# EAGLE design EtchASketch (EAGLE 9.6.2)
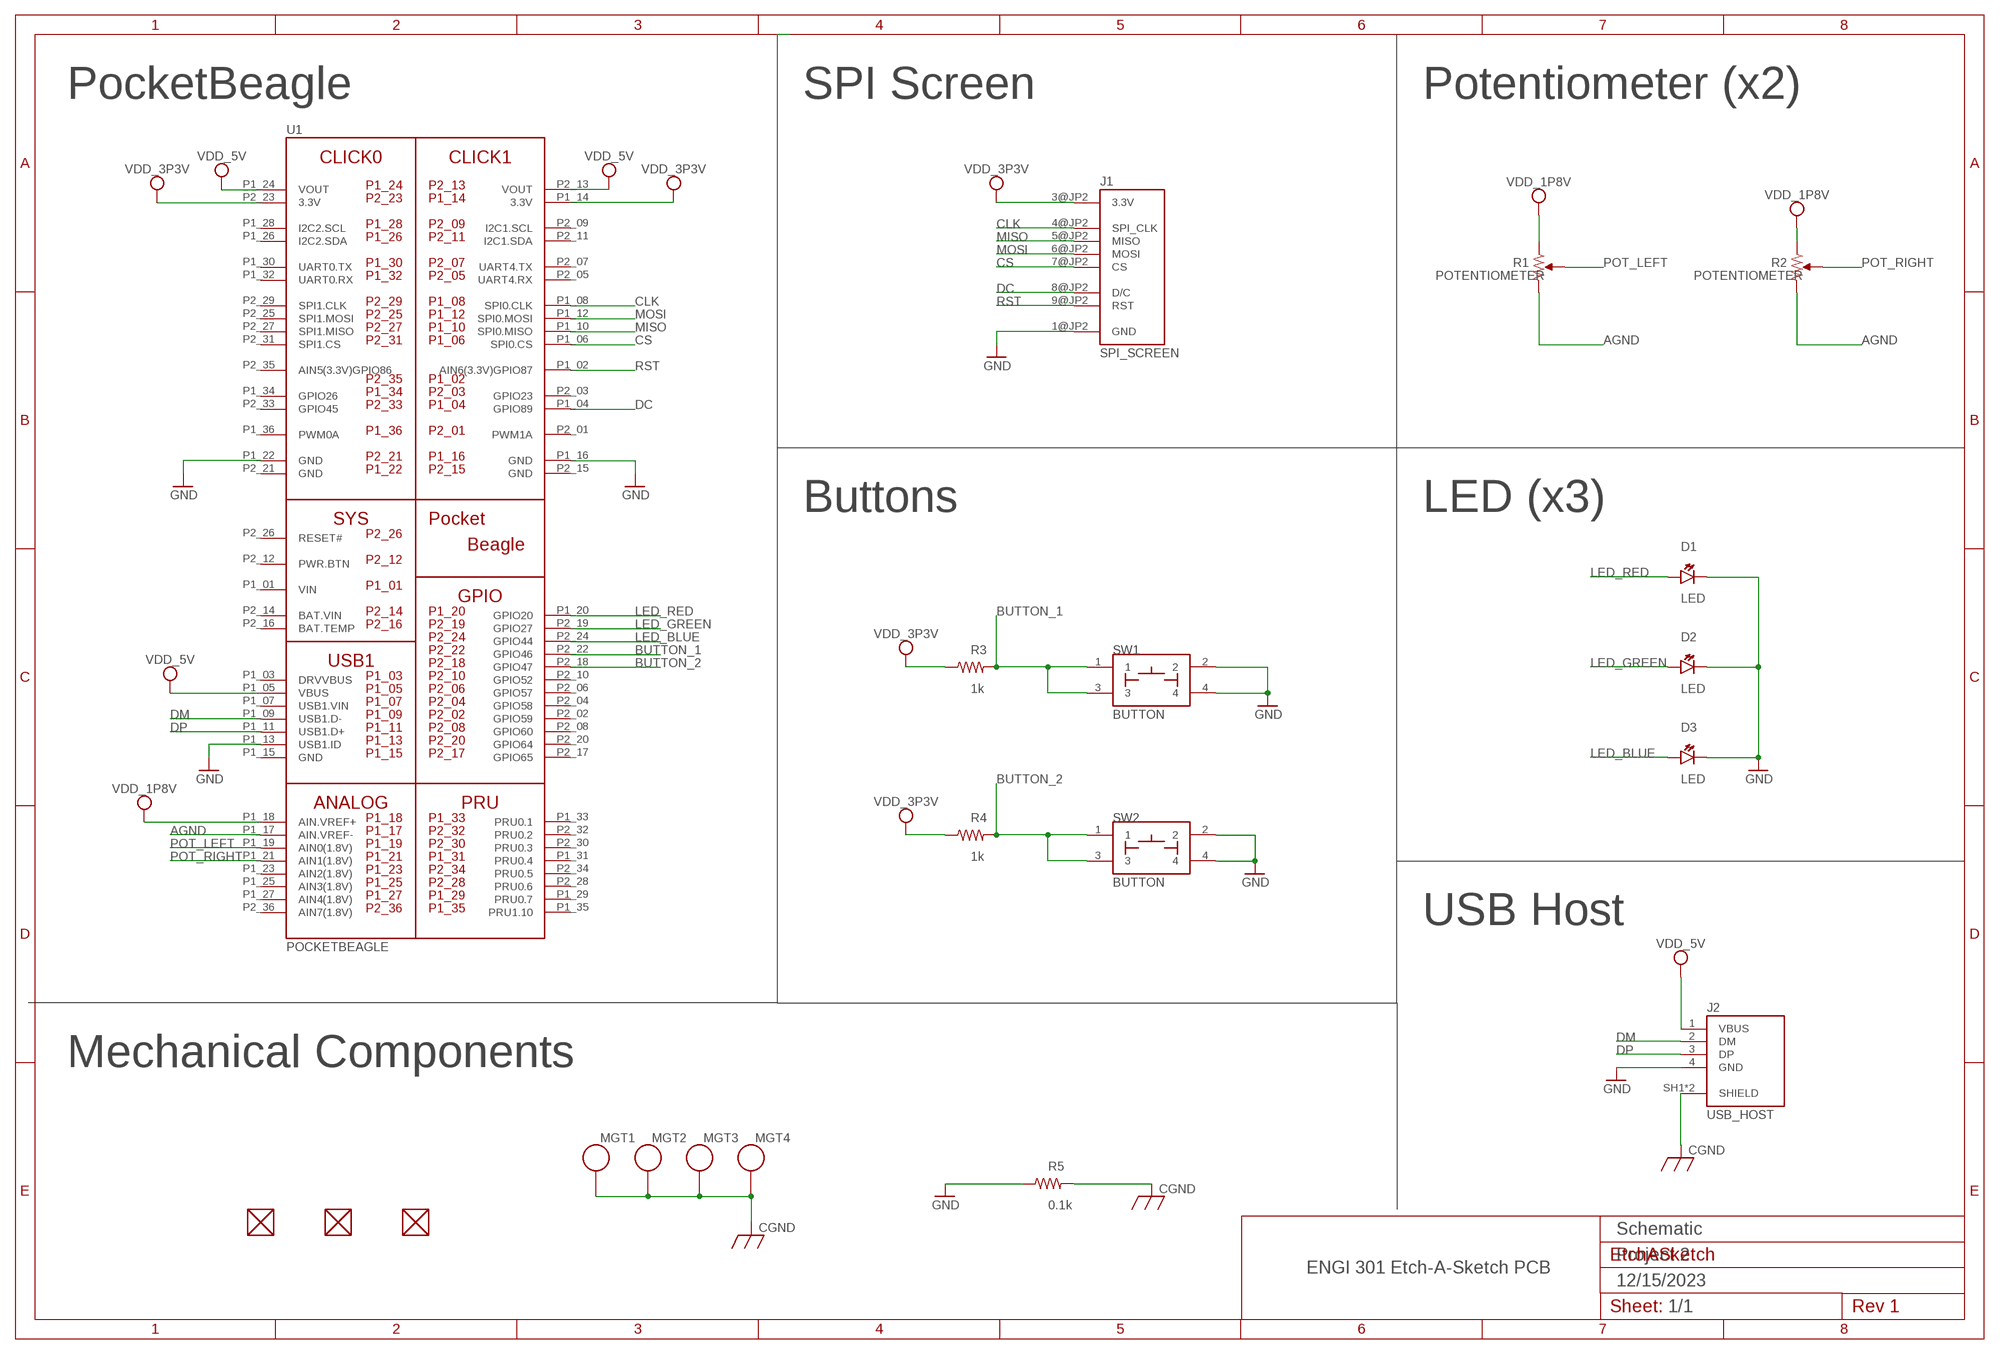
[diagram p0: schematic, sheet 1]

## Parts
D1  LED  [EIA-STD]
D2  LED  [EIA-STD]
D3  LED  [EIA-STD]
FUD4  FIDUCIAL  [FIDUCIAL_40MIL]
FUD5  FIDUCIAL  [FIDUCIAL_40MIL]
FUD6  FIDUCIAL  [FIDUCIAL_40MIL]
J1  SPI_SCREEN  [SPI_SCREEN]
J2  USB_HOST  [USB_TE_292303]
MGT1  MOUNTING_HOLE  [MOUNTING_HOLE]
MGT2  MOUNTING_HOLE  [MOUNTING_HOLE]
MGT3  MOUNTING_HOLE  [MOUNTING_HOLE]
MGT4  MOUNTING_HOLE  [MOUNTING_HOLE]
R1  POTENTIOMETER  [POT-PO90S]
R2  POTENTIOMETER  [POT-PO90S]
R3  1k  R_R0603  [R0603]
R4  1k  R_R0603  [R0603]
R5  0.1k  R_R0603  [R0603]
SW1  BUTTON  [BUTTON_12.5MM]
SW2  BUTTON  [BUTTON_12.5MM]
U1  POCKETBEAGLE  [POCKETBEAGLE]

## Nets
AGND: R1.CW R2.CW U1.P1_17(AIN.VREF-)
BUTTON_1: R3.2 SW1.1 SW1.3 U1.P2_22(GPIO46)
BUTTON_2: R4.2 SW2.1 SW2.3 U1.P2_18(GPIO47)
CGND: J2.SH1(SHIELD) J2.SH2(SHIELD) MGT1.P$1 MGT2.P$1 MGT3.P$1 MGT4.P$1 R5.2
CLK: J1.4@JP2(SPI_CLK) U1.P1_08(SPI0.CLK)
CS: J1.7@JP2(CS) U1.P1_06(SPI0.CS)
DC: J1.8@JP2(D/C) U1.P1_04(GPIO89)
DM: J2.2(DM) U1.P1_09(USB1.D-)
DP: J2.3(DP) U1.P1_11(USB1.D+)
GND: D1.CATHODE D2.CATHODE D3.CATHODE J1.1@JP2(GND) J2.4(GND) R5.1 SW1.2 SW1.4 SW2.2 SW2.4 U1.P1_13(USB1.ID) U1.P1_16(GND) U1.P1_22(GND)
LED_BLUE: D3.ANODE U1.P2_24(GPIO44)
LED_GREEN: D2.ANODE U1.P2_19(GPIO27)
LED_RED: D1.ANODE U1.P1_20(GPIO20)
MISO: J1.5@JP2(MISO) U1.P1_10(SPI0.MISO)
MOSI: J1.6@JP2(MOSI) U1.P1_12(SPI0.MOSI)
POT_LEFT: R1.S U1.P1_19(AIN0(1.8V))
POT_RIGHT: R2.S U1.P1_21(AIN1(1.8V))
RST: J1.9@JP2(RST) U1.P1_02(AIN6(3.3V)GPIO87)
VDD_1P8V: R1.CCW R2.CCW U1.P1_18(AIN.VREF+)
VDD_3P3V: J1.3@JP2(3.3V) R3.1 R4.1 U1.P1_14(3.3V) U1.P2_23(3.3V)
VDD_5V: J2.1(VBUS) U1.P1_05(VBUS) U1.P1_24(VOUT) U1.P2_13(VOUT)
Unconnected: FUD4.P$1 FUD5.P$1 FUD6.P$1 U1.P1_03(DRVVBUS) U1.P1_07(USB1.VIN) U1.P1_15(GND) U1.P1_23(AIN2(1.8V)) U1.P1_25(AIN3(1.8V)) U1.P1_26(I2C2.SDA) U1.P1_27(AIN4(1.8V)) U1.P1_28(I2C2.SCL) U1.P1_29(PRU0.7) U1.P1_30(UART0.TX) U1.P1_31(PRU0.4) U1.P1_32(UART0.RX) U1.P1_33(PRU0.1) U1.P1_34(GPIO26) U1.P1_35(PRU1.10) U1.P1_36(PWM0A) U1.P2_01(PWM1A) U1.P2_02(GPIO59) U1.P2_03(GPIO23) U1.P2_04(GPIO58) U1.P2_05(UART4.RX) U1.P2_06(GPIO57) U1.P2_07(UART4.TX) U1.P2_08(GPIO60) U1.P2_09(I2C1.SCL) U1.P2_10(GPIO52) U1.P2_11(I2C1.SDA) U1.P2_12(PWR.BTN) U1.P2_16(BAT.TEMP) U1.P2_17(GPIO65) U1.P2_20(GPIO64) U1.P2_25(SPI1.MOSI) U1.P2_26(RESET#) U1.P2_27(SPI1.MISO) U1.P2_28(PRU0.6) U1.P2_29(SPI1.CLK) U1.P2_30(PRU0.3) U1.P2_31(SPI1.CS) U1.P2_32(PRU0.2) U1.P2_33(GPIO45) U1.P2_34(PRU0.5) U1.P2_35(AIN5(3.3V)GPIO86) U1.P2_36(AIN7(1.8V))

## Notes on the sheet
- PocketBeagle | SPI Screen | Potentiometer (x2)
- Buttons | LED (x3)
- USB Host
- Mechanical Components
- Schematic
- Project 2
- ENGI 301 Etch-A-Sketch PCB
- 12/15/2023
- 1/1

## Power pins joined to a net without a drawn wire
BAT.VIN: U1.P2_14(BAT.VIN)
GND: U1.P2_15(GND) U1.P2_21(GND)
VIN: U1.P1_01(VIN)

## Library data of the parts
D1-D3 = Etch_a_Sketch:LED: EIA-STD LED, LTST-C191TBKT
FUD4-FUD6 = Etch_a_Sketch:FIDUCIAL
J1 = Etch_a_Sketch:SPI_SCREEN: 2.8" Adafruit SPI Display
J2 = Etch_a_Sketch:USB_HOST: CONN USB RECEPT R/A TYPE A 4POS Check availability <https://pricing.snapeda.com/parts/292303-1/TE%20Connectivity/view-part?ref=eda>; AVAILABILITY: In Stock; CENTERLINE_PITCH: 2 mm[.078 in]; COMMENT: 292303-1; DESCRIPTION: Conn; Data; USB; Recept; 2.0; 4 Pos; 1 Port; Rt Angle; A Ser; Tin over Copper; EU_ROHS_COMPLIANCE: Compliant; MF: TE Connectivity; MP: 292303-1; NUMBER_OF_POSITIONS: 4; PACKAGE: None; PRICE: None; PRODUCT_TYPE: Connector; PURCHASE-URL: https://pricing.snapeda.com/search/part/292303-1/?ref=eda
MGT1-MGT4 = Etch_a_Sketch:MOUNTING_HOLE: Chassis Mounting Hole w/GND connection ability
R1 R2 = Etch_a_Sketch:POTENTIOMETER: Potentiometer - Examples: P090S-14T20BR10K (987-1277-ND)
R3-R5 = Etch_a_Sketch:R_: RESISTOR, American symbol
SW1 SW2 = Etch_a_Sketch:BUTTON
U1 = Etch_a_Sketch:POCKETBEAGLE

## Board
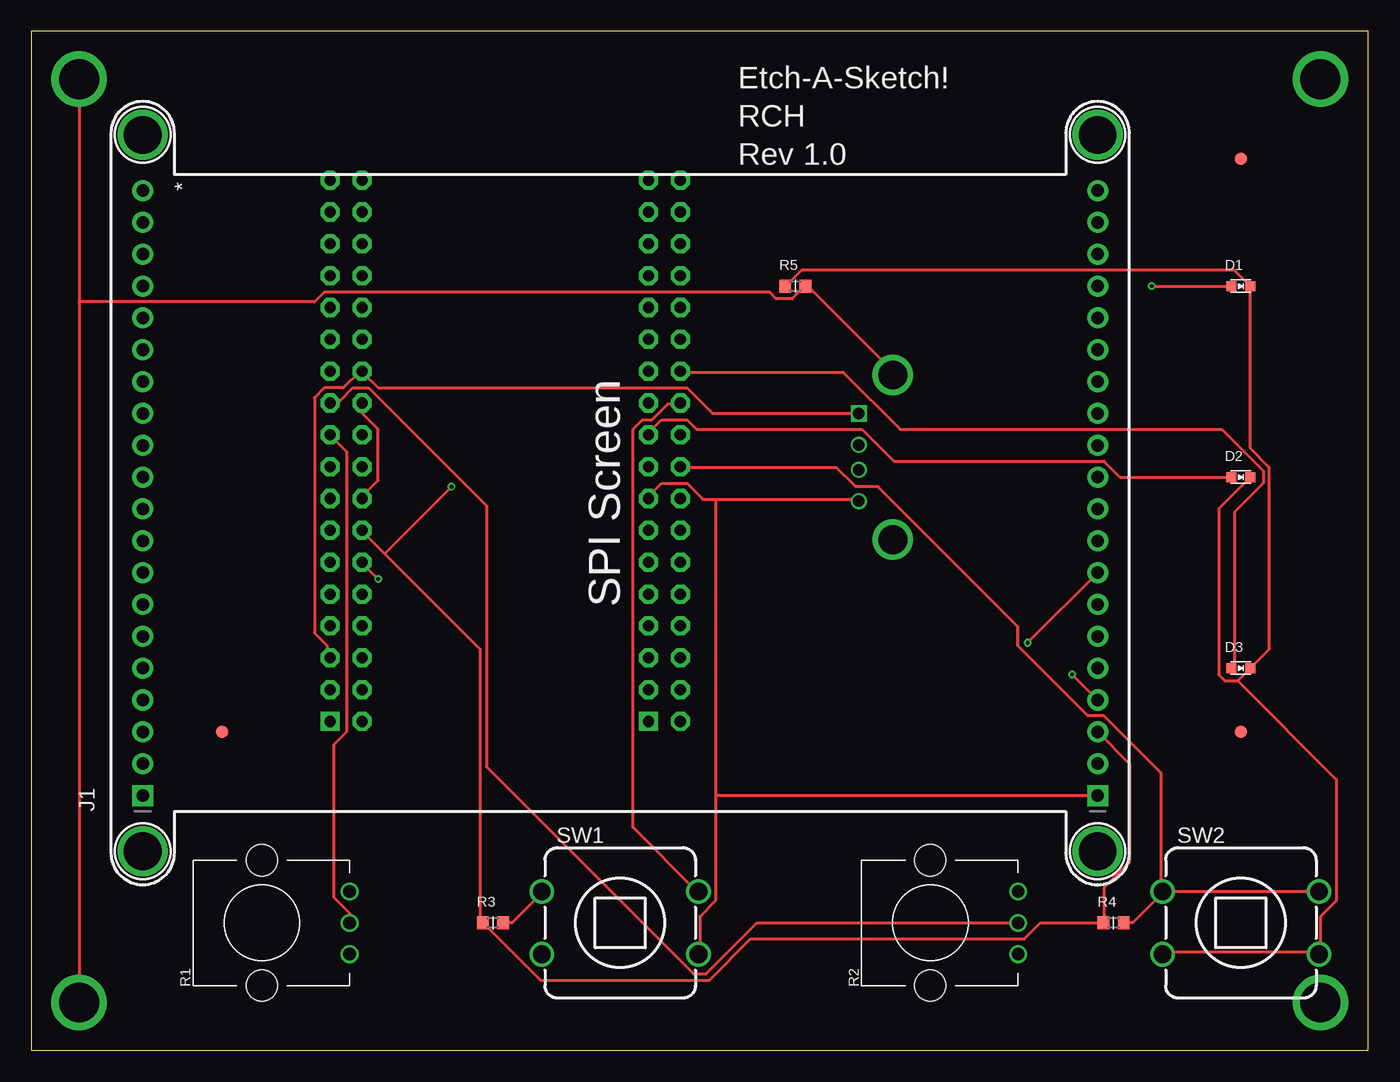
[diagram p1: board, top side]
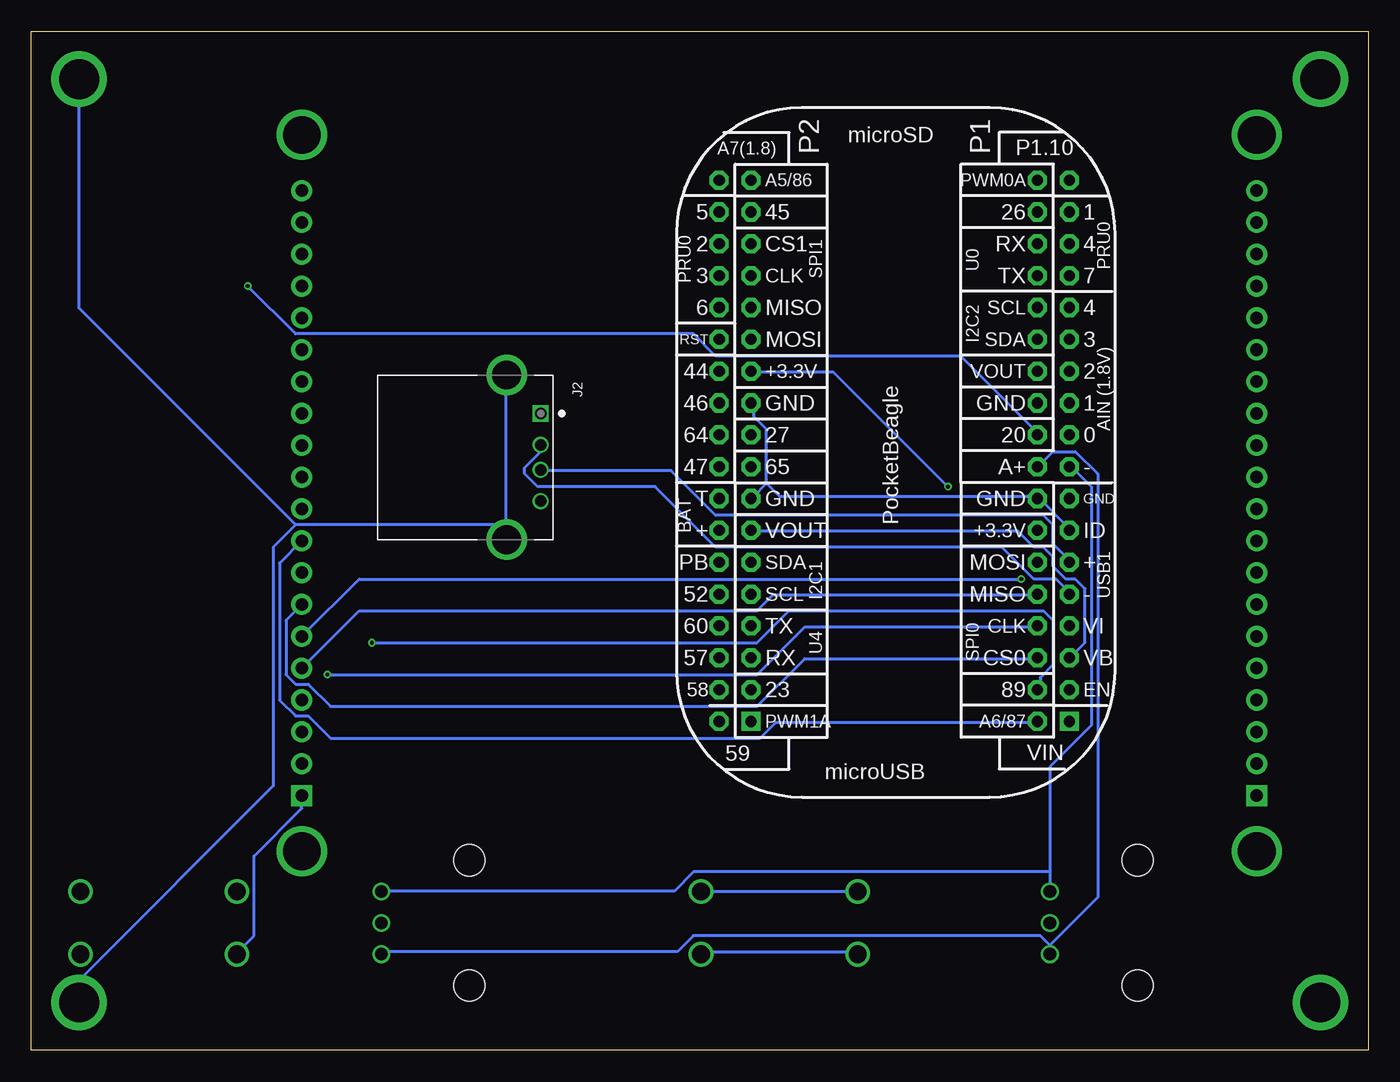
[diagram p2: board, bottom side, seen from below]

Size 106.68 x 81.28 mm. Coordinates in mm from the lower left corner, seen from the top.
Outline: 0,0 106.68,0 106.68,81.28 0,81.28 0,0
Copper layers (1*2*15*16): Top 0.035mm / dielectric 0.23mm / Route2 0.035mm / dielectric 0.93mm / Route15 0.035mm / dielectric 0.23mm / Bottom 0.035mm
Design rules "ENGI301_4lyr": minimum track width 10mil, minimum drill 12mil, track to track 10mil, track to pad 10mil, pad to pad 10mil, via to via 10mil, smd to smd 10mil, copper to edge 10mil, drill to drill 12mil, minimum pad ring 6mil, minimum via ring 6mil, stop-mask expansion 3mil, vias tented up to drill 25mil, thermal gap 10mil

### Footprints (pad centres in the part's own frame; a part is rotated, then mirrored left to right if it is on the bottom)
EIA-STD = smd 0.8 x 0.8: ANODE -0.75,0; CATHODE 0.75,0
FIDUCIAL_40MIL = smd 1.016 x 1.016: P$1 0,0
SPI_SCREEN = drill 1 pad 1.676 square: 1@JP1 -24.13,38.1; 1@JP2 -24.13,-38.1 | drill 1 pad 1.676: 2@JP1 -21.59,38.1; 2@JP2 -21.59,-38.1; 3@JP1 -19.05,38.1; 3@JP2 -19.05,-38.1; 4@JP1 -16.51,38.1; 4@JP2 -16.51,-38.1; 5@JP1 -13.97,38.1; 5@JP2 -13.97,-38.1; 6@JP1 -11.43,38.1; 6@JP2 -11.43,-38.1; 7@JP1 -8.89,38.1; 7@JP2 -8.89,-38.1; 8@JP1 -6.35,38.1; 8@JP2 -6.35,-38.1; 9@JP1 -3.81,38.1; 9@JP2 -3.81,-38.1; 10@JP1 -1.27,38.1; 10@JP2 -1.27,-38.1; 11@JP1 1.27,38.1; 11@JP2 1.27,-38.1; 12@JP1 3.81,38.1; 12@JP2 3.81,-38.1; 13@JP1 6.35,38.1; 13@JP2 6.35,-38.1; 14@JP1 8.89,38.1; 14@JP2 8.89,-38.1; 15@JP1 11.43,38.1; 15@JP2 11.43,-38.1; 16@JP1 13.97,38.1; 16@JP2 13.97,-38.1; 17@JP1 16.51,38.1; 17@JP2 16.51,-38.1; 18@JP1 19.05,38.1; 18@JP2 19.05,-38.1; 19@JP1 21.59,38.1; 19@JP2 21.59,-38.1; 20@JP1 24.13,38.1; 20@JP2 24.13,-38.1 | drill 3 pad 3.6: P$1@U$7 -28.575,-38.1; P$1@U$15 28.575,-38.1; P$1@U$16 -28.575,38.1; P$1@U$17 28.575,38.1
USB_TE_292303 = drill 0.92 square: 1 0,0 | drill 0.92: 2 2.5,0; 3 4.5,0; 4 7,0 | drill 2.3: SH1 -3.07,-2.71; SH2 10.07,-2.71
MOUNTING_HOLE = drill 3.175 pad 4.445: P$1 0,0
POT-PO90S = drill 1: CCW -2.5,0; CW 2.5,0; S 0,0 | hole 2.5: -5,7; 5,7
R0603 = smd 0.95 x 1.031: 1 -0.8,0; 2 0.8,0
BUTTON_12.5MM = drill 1.4: 1 -6.25,2.5; 2 -6.25,-2.5; 3 6.25,2.5; 4 6.25,-2.5
POCKETBEAGLE = drill 0.889 pad 1.524 square: P1_01 5.91,3.53; P2_01 5.91,28.93 | drill 0.889 pad 1.524 octagon: P1_02 5.91,6.07; P1_03 8.45,3.53; P1_04 8.45,6.07; P1_05 10.99,3.53; P1_06 10.99,6.07; P1_07 13.53,3.53; P1_08 13.53,6.07; P1_09 16.07,3.53; P1_10 16.07,6.07; P1_11 18.61,3.53; P1_12 18.61,6.07; P1_13 21.15,3.53; P1_14 21.15,6.07; P1_15 23.69,3.53; P1_16 23.69,6.07; P1_17 26.23,3.53; P1_18 26.23,6.07; P1_19 28.77,3.53; P1_20 28.77,6.07; P1_21 31.31,3.53; P1_22 31.31,6.07; P1_23 33.85,3.53; P1_24 33.85,6.07; P1_25 36.39,3.53; P1_26 36.39,6.07; P1_27 38.93,3.53; P1_28 38.93,6.07; P1_29 41.47,3.53; P1_30 41.47,6.07; P1_31 44.01,3.53; P1_32 44.01,6.07; P1_33 46.55,3.53; P1_34 46.55,6.07; P1_35 49.09,3.53; P1_36 49.09,6.07; P2_02 5.91,31.47; P2_03 8.45,28.93; P2_04 8.45,31.47; P2_05 10.99,28.93; P2_06 10.99,31.47; P2_07 13.53,28.93; P2_08 13.53,31.47; P2_09 16.07,28.93; P2_10 16.07,31.47; P2_11 18.61,28.93; P2_12 18.61,31.47; P2_13 21.15,28.93; P2_14 21.15,31.47; P2_15 23.69,28.93; P2_16 23.69,31.47; P2_17 26.23,28.93; P2_18 26.23,31.47; P2_19 28.77,28.93; P2_20 28.77,31.47; P2_21 31.31,28.93; P2_22 31.31,31.47; P2_23 33.85,28.93; P2_24 33.85,31.47; P2_25 36.39,28.93; P2_26 36.39,31.47; P2_27 38.93,28.93; P2_28 38.93,31.47; P2_29 41.47,28.93; P2_30 41.47,31.47; P2_31 44.01,28.93; P2_32 44.01,31.47; P2_33 46.55,28.93; P2_34 46.55,31.47; P2_35 49.09,28.93; P2_36 49.09,31.47

### Placement (x,y rotation side)
D1  96.52,60.96 0 top
D2  96.52,45.72 0 top
D3  96.52,30.48 0 top
FUD4  15.24,25.4 0 top
FUD5  96.52,71.12 0 top
FUD6  96.52,25.4 0 top
J1  46.99,44.45 90 top
J2  66.04,50.8 270 bottom
MGT1  102.87,77.47 0 top
MGT2  102.87,3.81 0 top
MGT3  3.81,77.47 0 top
MGT4  3.81,3.81 0 top
R1  25.4,10.16 90 top
R2  78.74,10.16 90 top
R3  36.83,10.16 0 top
R4  86.36,10.16 0 top
R5  60.96,60.96 0 top
SW1  46.99,10.16 0 top
SW2  96.52,10.16 0 top
U1  20.32,20.32 90 bottom

### Tracks (layer width: path | path; a pad name or v marks a point on that pad's centre or on a via)
AGND
  Bottom 0.254: 25.4,14.22 25.4,22.61 22.1,25.91 22.1,44.96 23.62,46.48 U1.P1_17 | 25.4,14.22 R1.CW | 25.4,14.22 53.85,14.22 55.37,12.7 78.74,12.7 R2.CW
BUTTON_1
  Top 0.254: R3.2 38.35,10.16 40.64,12.45 SW1.1 | U1.P2_22 51.56,51.56 50.8,51.56 49.53,50.29 48.77,50.29 48.01,49.53 48.01,17.78 53.09,12.7 SW1.3
  Bottom 0.254: SW1.1 40.89,12.7 53.09,12.7 SW1.3
BUTTON_2
  Top 0.254: R4.2 87.88,10.16 90.17,12.45 SW2.1 | U1.P2_18 51.82,46.48 64.26,46.48 65.79,44.96 67.56,44.96 78.74,33.78 78.74,32.26 84.33,26.67 85.6,26.67 90.17,22.1 90.17,12.7 SW2.1 | SW2.3 102.62,12.7 90.42,12.7 SW2.1
CGND
  Top 0.254: MGT3.P$1 3.81,59.69 | 3.81,59.69 MGT4.P$1 | J2.SH1 68.83,54.1 61.98,60.96 R5.2 61.72,60.96 60.71,59.94 59.44,59.94 58.93,60.45 23.37,60.45 22.61,59.69 3.81,59.69
  Bottom 0.254: 68.83,41.91 68.83,53.85 J2.SH1 | 68.83,41.91 68.83,40.89 J2.SH2 68.83,41.91 | MGT2.P$1 102.87,5.59 87.38,21.08 87.38,40.13 85.6,41.91 | 68.83,41.91 85.6,41.91 | MGT1.P$1 102.87,59.18 85.6,41.91
CLK  (via drill 0.3)
  Top 0.254: J1.4@JP2 v83.06,29.97
  Bottom 0.254: v83.06,29.97 48.77,29.97 44.96,33.78 26.42,33.78 U1.P1_08
CS
  Bottom 0.254: J1.7@JP2 86.36,34.29 86.36,29.97 85.6,29.21 84.58,29.21 82.8,27.43 48.77,27.43 44.96,31.24 26.42,31.24 U1.P1_06
DC  (via drill 0.3)
  Top 0.254: J1.8@JP2 v79.5,32.51
  Bottom 0.254: v79.5,32.51 48.77,32.51 46.23,35.05 25.91,35.05 25.15,34.29 25.15,30.73 26.16,29.72 26.16,28.96 U1.P1_04
DM
  Bottom 0.254: J2.2 66.04,47.75 67.31,46.48 67.31,45.97 66.29,44.96 56.9,44.96 52.07,40.13 29.21,40.13 26.67,37.59 24.89,37.59 23.88,36.58 U1.P1_09
DP
  Bottom 0.254: J2.3 66.04,46.23 55.63,46.23 52.07,42.67 25.91,42.67 25.15,41.91 25.15,40.39 23.88,39.12 U1.P1_11
GND
  Top 0.254: U1.P1_22 26.42,51.56 26.42,50.8 27.69,49.53 27.69,45.47 26.42,44.2 U1.P1_16 | 54.61,43.94 53.59,43.94 52.32,45.21 50.29,45.21 49.28,44.2 U1.P2_15 | 54.61,43.94 66.04,43.94 J2.4 | 54.61,43.94 54.61,20.32 | 54.61,20.32 54.61,11.94 53.34,10.67 53.34,7.87 SW1.4 | SW2.2 90.42,7.87 102.62,7.87 SW2.4 102.87,7.87 102.87,10.67 104.14,11.94 104.14,21.59 96.27,29.46 | 96.27,29.46 97.03,30.23 97.03,30.48 D3.CATHODE 97.28,30.48 98.81,32 98.81,46.48 97.28,48.01 97.28,60.96 | 96.27,29.46 95.25,29.46 94.74,29.97 94.74,43.18 97.28,45.72 D2.CATHODE | 97.28,60.96 96.01,62.23 61.47,62.23 60.2,60.96 R5.1 | 97.28,60.96 D1.CATHODE | J1.1@JP2 54.61,20.32
  Bottom 0.254: SW1.2 40.89,7.87 53.09,7.87 SW1.4 | U1.P1_13 23.88,41.66 26.16,43.94 U1.P1_16 26.42,44.2 46.99,44.2 48.01,45.21 | 48.01,45.21 48.01,49.53 49.02,50.55 49.02,51.56 U1.P2_21 | 48.01,45.21 49.02,44.2 U1.P2_15 | J1.1@JP2 85.09,19.3 88.9,15.49 88.9,9.14 90.17,7.87 SW2.2
LED_BLUE
  Top 0.254: D3.ANODE 96.01,30.48 96.01,42.93 98.3,45.21 98.3,46.23 95,49.53 69.34,49.53 64.77,54.1 51.82,54.1 U1.P2_24
LED_GREEN
  Top 0.254: D2.ANODE 86.87,45.72 85.6,46.99 68.83,46.99 66.29,49.53 53.09,49.53 52.32,50.29 50.29,50.29 49.28,49.28 U1.P2_19
LED_RED  (via drill 0.3)
  Top 0.254: v89.41,60.96 D1.ANODE
  Bottom 0.254: v89.41,60.96 85.6,57.15 53.85,57.15 52.07,55.37 32.51,55.37 26.42,49.28 U1.P1_20
MISO
  Bottom 0.254: J1.5@JP2 80.52,35.05 48.77,35.05 47.5,36.32 26.42,36.32 U1.P1_10
MOSI  (via drill 0.3)
  Top 0.254: v27.69,37.59 26.42,38.86 U1.P1_12
  Bottom 0.254: v27.69,37.59 80.52,37.59 J1.6@JP2
POT_LEFT
  Top 0.254: R1.S 25.4,10.92 24.13,12.19 24.13,24.38 25.15,25.4 25.15,47.75 23.88,49.02 U1.P1_19
POT_RIGHT
  Top 0.254: R2.S 57.91,10.16 53.85,6.1 52.83,6.1 36.32,22.61 36.32,43.43 26.92,52.83 25.65,52.83 24.64,51.82 23.88,51.82 U1.P1_21
RST
  Bottom 0.254: J1.9@JP2 86.87,38.86 86.87,27.94 85.6,26.67 84.58,26.67 82.8,24.89 48.51,24.89 47.24,26.16 26.42,26.16 U1.P1_02
VDD_1P8V
  Bottom 0.254: 25.4,8.38 R1.CCW | 25.4,8.38 21.59,12.19 21.59,45.97 23.37,47.75 25.15,47.75 26.16,46.74 U1.P1_18 | 25.4,8.38 26.16,9.14 53.85,9.14 55.12,7.87 78.74,7.87 R2.CCW
VDD_3P3V  (via drill 0.3)
  Top 0.254: J1.3@JP2 87.63,22.86 87.63,14.99 85.6,12.95 85.6,10.16 R4.1 80.52,10.16 79.25,8.89 57.4,8.89 54.1,5.59 40.64,5.59 36.07,10.16 R3.1 35.81,10.16 35.81,32 28.19,39.62 | 28.19,39.62 26.42,41.4 U1.P1_14 | 28.19,39.62 v33.53,44.96
  Bottom 0.254: v33.53,44.96 42.67,54.1 49.02,54.1 U1.P2_23
VDD_5V
  Top 0.254: J2.1 54.36,50.8 52.32,52.83 27.69,52.83 26.42,54.1 U1.P1_24 26.16,54.1 24.89,52.83 23.37,52.83 22.61,52.07 22.61,33.27 23.62,32.26 23.62,31.5 U1.P1_05
  Bottom 0.254: U1.P2_13 49.02,41.4 27.94,41.4 26.67,40.13 25.91,40.13 25.15,39.37 25.15,38.61 24.13,37.59 23.37,37.59 22.61,36.83 22.61,32.51 23.62,31.5 U1.P1_05

### Text on the board
tPlace: Etch-A-Sketch! | RCH | Rev 1.0